# Altium schematic sheet CAN_mux.SchDoc
size A4; SheetNumber: 6; SheetTotal: 6
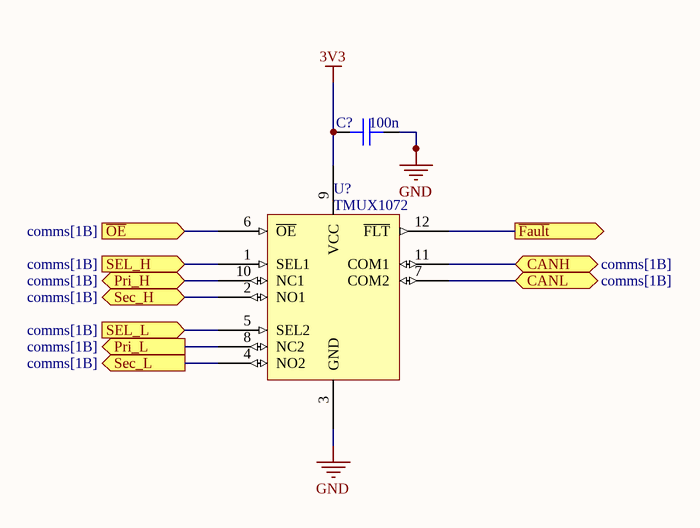
[diagram p0: CAN_mux.SchDoc]

## Parts
C?  100n
U?  TMUX1072

## Ports
CANH (bidir, see comms[1B]), CANL (bidir, see comms[1B]), Pri_H (bidir, see comms[1B]), Pri_L (out, see comms[1B]), Sec_H (bidir, see comms[1B]), Sec_L (out, see comms[1B]), SEL_H (in, see comms[1B]), SEL_L (in, see comms[1B]), ~{Fault} (out), ~{OE} (in, see comms[1B])

## Nets
3V3: C?.2 U?.9(VCC)
GND: C?.1 U?.3(GND)
~{Fault}: U?.12(~{FLT}) ; port ~{Fault}
~{OE}: U?.6(~{OE}) ; port ~{OE}
CANH: U?.11(COM1) ; port CANH
CANL: U?.7(COM2) ; port CANL
Pri_H: U?.10(NC1) ; port Pri_H
Pri_L: U?.8(NC2) ; port Pri_L
Sec_H: U?.2(NO1) ; port Sec_H
Sec_L: U?.4(NO2) ; port Sec_L
SEL_H: U?.1(SEL1) ; port SEL_H
SEL_L: U?.5(SEL2) ; port SEL_L

## Library data of the parts
C? = Capacitor
U? = TMUX1072: 2-Channel 2:1 Analog Multiplexer with Overvoltage Detection and Protection